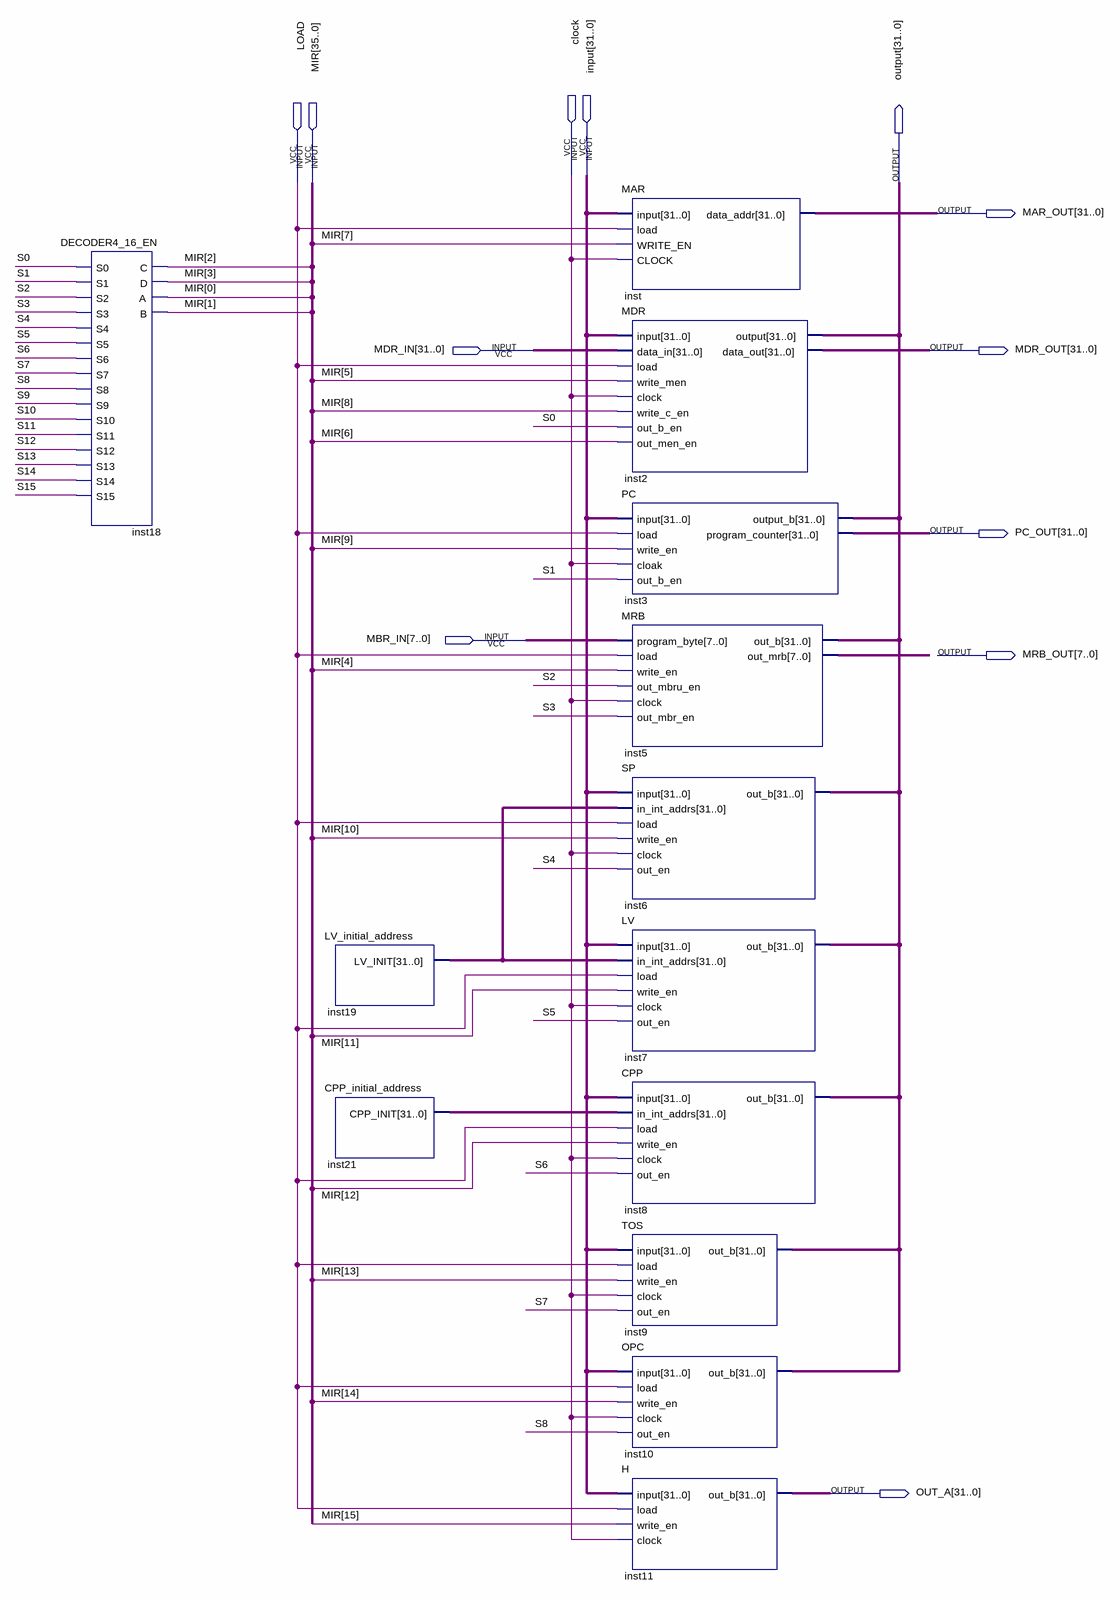
[diagram p0: schematic sheet]
// Quartus schematic BANCO_REGISTRADORES.bdf as structural Verilog: 13 symbols, 12 pins
module BANCO_REGISTRADORES (
  input  clock,
  input  [31:0] \input ,
  input  LOAD,
  input  [35:0] MIR,
  input  [31:0] MDR_IN,
  input  [7:0] MBR_IN,
  output [31:0] \output ,
  output [31:0] MAR_OUT,
  output [31:0] MDR_OUT,
  output [31:0] PC_OUT,
  output [7:0] MRB_OUT,
  output [31:0] OUT_A
);

  wire S0, S1, S2, S3, S4, S5, S6, S7, S8, S9, S10, S11, S12, S13, S14, S15;
  wire [7:0] inst5_out_mrb;
  wire [31:0] inst19_lv_init, inst21_cpp_init;

  DECODER4_16_EN inst18 (
    .C(MIR[2]), .D(MIR[3]), .A(MIR[0]), .B(MIR[1]), .S0(S0), .S1(S1), .S2(S2), .S3(S3), .S4(S4), .S5(S5),
    .S6(S6), .S7(S7), .S8(S8), .S9(S9), .S10(S10), .S11(S11), .S12(S12), .S13(S13), .S14(S14), .S15(S15));
  LV_initial_address inst19 (.LV_INIT(inst19_lv_init));
  CPP_initial_address inst21 (.CPP_INIT(inst21_cpp_init));
  MAR inst (.\input (\input ), .load(LOAD), .WRITE_EN(MIR[7]), .CLOCK(clock), .data_addr(MAR_OUT));
  MDR inst2 (
    .\input (\input ), .data_in(MDR_IN), .load(LOAD), .write_men(MIR[5]), .clock(clock), .write_c_en(MIR[8]),
    .out_b_en(S0), .out_men_en(MIR[6]), .\output (\output ), .data_out(MDR_OUT));
  PC inst3 (
    .\input (\input ), .load(LOAD), .write_en(MIR[9]), .cloak(clock), .out_b_en(S1), .output_b(\output ),
    .program_counter(PC_OUT));
  MRB inst5 (
    .program_byte(MBR_IN), .load(LOAD), .write_en(MIR[4]), .out_mbru_en(S2), .clock(clock), .out_mbr_en(S3),
    .out_b(\output ), .out_mrb(inst5_out_mrb));
  SP inst6 (
    .\input (\input ), .in_int_addrs(inst19_lv_init), .load(LOAD), .write_en(MIR[10]), .clock(clock),
    .out_en(S4), .out_b(\output ));
  LV inst7 (
    .\input (\input ), .in_int_addrs(inst19_lv_init), .load(LOAD), .write_en(MIR[11]), .clock(clock),
    .out_en(S5), .out_b(\output ));
  CPP inst8 (
    .\input (\input ), .in_int_addrs(inst21_cpp_init), .load(LOAD), .write_en(MIR[12]), .clock(clock),
    .out_en(S6), .out_b(\output ));
  TOS inst9 (.\input (\input ), .load(LOAD), .write_en(MIR[13]), .clock(clock), .out_en(S7), .out_b(\output ));
  OPC inst10 (.\input (\input ), .load(LOAD), .write_en(MIR[14]), .clock(clock), .out_en(S8), .out_b(\output ));
  H inst11 (.\input (\input ), .load(LOAD), .write_en(MIR[15]), .clock(clock), .out_b(OUT_A));
endmodule
